# Altium schematic sheet PCB_ManufactureDiagram.SchDoc
size A4; SheetNumber: 6; SheetTotal: 6
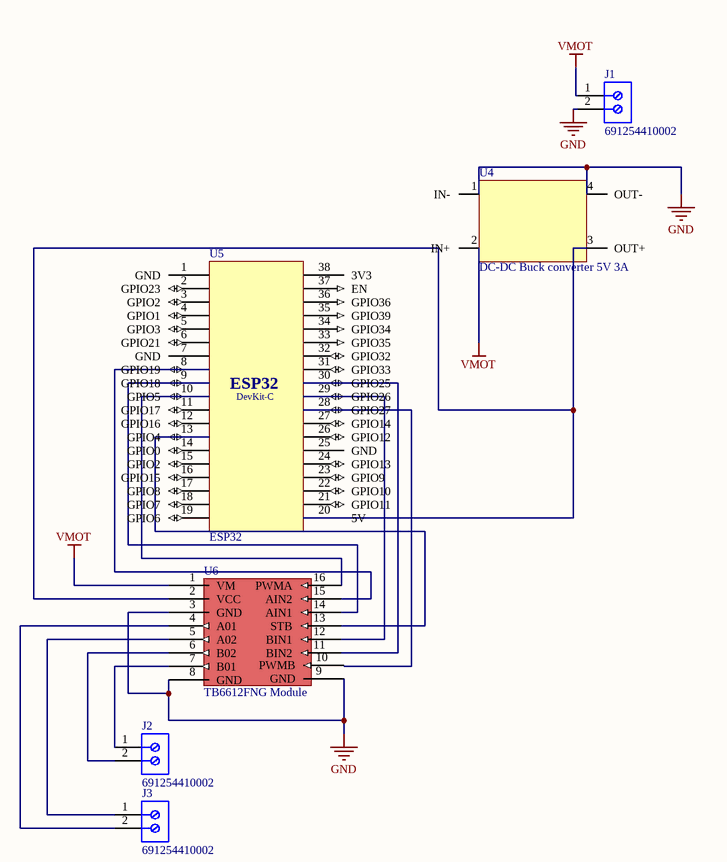
[diagram p0: PCB_ManufactureDiagram.SchDoc]

## Parts
J1  691254410002  [691254410002]
J2  691254410002  [691254410002]
J3  691254410002  [691254410002]
U4  DC-DC Buck converter 5V 3A  [DC-DC Buck converter 5V 3A]
U5  ESP32  [ESP32_DevKitCWROOM32]
U6  TB6612FNG Module  [TB6612FNG]

## Nets
GND: J1.2 U4.1(IN-) U4.4(OUT-) U6.3(GND) U6.8(GND) U6.9(GND)
VMOT: J1.1 U4.2(IN+) U6.1(VM)
NetJ2_1: J2.1 U6.7(B01)
NetJ2_2: J2.2 U6.6(B02)
NetJ3_1: J3.1 U6.5(A02)
NetJ3_2: J3.2 U6.4(A01)
NetU4_3: U4.3(OUT+) U5.20(5V) U6.2(VCC)
NetU5_8: U5.8(GPIO19) U6.15(AIN2)
NetU5_9: U5.9(GPIO18) U6.14(AIN1)
NetU5_10: U5.10(GPIO5) U6.16(PWMA)
NetU5_13: U5.13(GPIO4) U6.13(STB)
NetU5_29: U5.29(GPIO26) U6.12(BIN1)
NetU5_30: U5.30(GPIO25) U6.11(BIN2)

Not connected (* = marked no-connect by the designer): U5 1(GND) 2(GPIO23) 3(GPIO2) 4(GPIO1) 5(GPIO3) 6(GPIO21) 7(GND) 11(GPIO17) 12(GPIO16) 14(GPIO0) 15(GPIO2) 16(GPIO15) 17(GPIO8) 18(GPIO7) 19(GPIO6) 21(GPIO11) 22(GPIO10) 23(GPIO9) 24(GPIO13) 25(GND) 26(GPIO12) 27(GPIO14) 28(GPIO27) 31(GPIO33) 32(GPIO32) 33(GPIO35) 34(GPIO34) 35(GPIO39) 36(GPIO36) 37(EN) 38(3V3); U6 10(PWMB)

## Notes on the sheet
- Documento:
- Autor:
- Carnet:
- Proyecto:
- Curso:
- Fecha:
- Revisión:
- Tamaño:
- Carta
- Hoja:
- de:
- (in symbol ESP32-WROOM32) DevKit-C

## Library data of the parts
J1-J3 = CMP-1502-02748-3: Terminal Block, 7.62MM Pitch, Horizontal, Dual Pin, 12-30 AWG, 2 Pin
U4 = DC-DC Buck converter 5V 3A: MP1584 Series 28 V 3 A 1.5 MHz SMT Step-Down Converter - SOIC-8E; Manufacturer: Monolithic Power Systems; Manufacturer Part Number: MP1584EN-LF-Z; Manufacturer Lifecycle Status: NRFND; Max Supply Voltage: 28V; Max Junction Temperature (Tj): 125°C; Max Output Voltage: 25V; Max Power Dissipation: 2.5W; Max Switching Frequency: 1.5MHz; Min Input Voltage: 4.5V; Min Output Voltage: 800mV; Nominal Supply Voltage: 12V; Nominal Supply Current: 100µA; Number of Channels: 1; Output Configuration: Positive; Output Type: Adjustable; Synchronous Rectifier: No; Supplier: DigiKey; Supplier Part Number: 1589-1533-1-ND; RoHS: Compliant; Category: Voltage Regulators - Switching; Stock: 3098; Pricing: 1=2.75, 10=2.051, 25=1.876, 100=1.6842, 250=1.59268, 500=1.53748, 1000=1.49207 (USD); Ambient Temperature Range High: 85°C; Case/Package: SOIC; Contact Plating: Tin; Height: 1.7mm; Height - Seated (Max): 1.7mm; Lead Free: Lead Free; Length: 4.9mm; Lifecycle Status: NRND; Max Operating Temperature: 85°C; Max Output current: 3A; Min Operating Temperature: -20°C; Min Supply Voltage: 4.5V; Mounting Technology: Surface Mount; Number of Circuits: 1; Number of Outputs: 1; Pins: 8; Number of Terminals: 8; Operating Supply Voltage: 28V; Output Current: 3A; Output Voltage: 25V; REACH SVHC: Yes; Switching Frequency: 1.5MHz; Terminal Pitch: 1.27mm; Topology: Buck; Width: 3.9mm; ComponentLink1URL: https://datasheet.octopart.com:443/MP1584EN-LF-Z-Monolithic-Power-Systems-datasheet-155981995.pdf?src-supplier=Monolithic+Power+Systems; ComponentLink1Description: https://datasheet.octopart.com:443/MP1584EN-LF-Z-Monolithic-Power-Systems-datasheet-155981995.pdf?src-supplier=Monolithic+Power+Systems; ComponentLink2URL: https://datasheet.octopart.com:443/MP1584EN-LF-Z-Monolithic-Power-Systems-datasheet-180786201.pdf?src-supplier=IHS; ComponentLink2Description: https://datasheet.octopart.com:443/MP1584EN-LF-Z-Monolithic-Power-Systems-datasheet-180786201.pdf?src-supplier=IHS; ComponentLink3URL: https://datasheet.octopart.com:443/MP1584EN-LF-Z-Monolithic-Power-Systems-datasheet-138896877.pdf?src-supplier=Upverter; ComponentLink3Description: https://datasheet.octopart.com:443/MP1584EN-LF-Z-Monolithic-Power-Systems-datasheet-138896877.pdf?src-supplier=Upverter; ComponentLink4URL: https://datasheet.octopart.com:443/MP1584EN-LF-Z-Monolithic-Power-Systems-datasheet-28355791.pdf?src-supplier=Augswan; ComponentLink4Description: https://datasheet.octopart.com:443/MP1584EN-LF-Z-Monolithic-Power-Systems-datasheet-28355791.pdf?src-supplier=Augswan; ComponentLink5URL: https://datasheet.octopart.com:443/MP1584EN-LF-Z-Monolithic-Power-Systems-datasheet-157246321.pdf?src-supplier=LKR; ComponentLink5Description: https://datasheet.octopart.com:443/MP1584EN-LF-Z-Monolithic-Power-Systems-datasheet-157246321.pdf?src-supplier=LKR; ComponentLink6URL: https://datasheet.octopart.com:443/MP1584EN-LF-Z-Monolithic-Power-Systems-datasheet-130112029.pdf?src-supplier=TME; ComponentLink6Description: https://datasheet.octopart.com:443/MP1584EN-LF-Z-Monolithic-Power-Systems-datasheet-130112029.pdf?src-supplier=TME; ComponentLink7URL: https://datasheet.octopart.com:443/MP1584EN-LF-Z-Monolithic-Power-Systems-datasheet-26504489.pdf?src-supplier=Future+Electronics; ComponentLink7Description: https://datasheet.octopart.com:443/MP1584EN-LF-Z-Monolithic-Power-Systems-datasheet-26504489.pdf?src-supplier=Future+Electronics
U5 = ESP32-WROOM32: Multiprotocol Modules SMD Module ESP32-WROOM-32E, ESP32-D0WD-V3, 16 MB SPI flash, PCB antenna; Manufacturer: Espressif Systems; Manufacturer Part Number: ESP32-WROOM-32E-N16; Max Supply Voltage: 3.6V; Min Supply Voltage: 3V; Operating Supply Voltage: 3.3V; Supplier: DigiKey; Supplier Part Number: 5407-ESP32-WROOM-32E-N16CT-ND; RoHS: Compliant; Category: RF Transceiver Modules and Modems; Stock: 9659; Pricing: 1=5.71, 10=4.941, 25=4.6748, 100=4.3087, 250=4.0894 (USD); Height - Seated (Max): 3.25mm; Harmonized Tariff Schedule (HTS) Code: 8542.31.00.30; Length: 25.5mm; Max Operating Temperature: 85°C; Min Operating Temperature: -40°C; Number of Terminals: 38; REACH SVHC: Yes; Terminal Pitch: 1.27mm; Width: 18mm; ComponentLink1URL: https://datasheet.octopart.com:443/ESP32-WROOM-32E-N16-Espressif-Systems-datasheet-182247776.pdf?src-supplier=IHS; ComponentLink1Description: https://datasheet.octopart.com:443/ESP32-WROOM-32E-N16-Espressif-Systems-datasheet-182247776.pdf?src-supplier=IHS; ComponentLink2URL: https://datasheet.octopart.com:443/ESP32-WROOM-32E-N16-Espressif-Systems-datasheet-192340067.pdf?src-supplier=HQonline; ComponentLink2Description: https://datasheet.octopart.com:443/ESP32-WROOM-32E-N16-Espressif-Systems-datasheet-192340067.pdf?src-supplier=HQonline; ComponentLink3URL: https://datasheet.octopart.com:443/ESP32-WROOM-32E-N16-Espressif-Systems-datasheet-188867343.pdf?src-supplier=TME; ComponentLink3Description: https://datasheet.octopart.com:443/ESP32-WROOM-32E-N16-Espressif-Systems-datasheet-188867343.pdf?src-supplier=TME; ComponentLink4URL: https://datasheet.octopart.com:443/ESP32-WROOM-32E-N16-Espressif-Systems-datasheet-165560559.pdf?src-supplier=TME; ComponentLink4Description: https://datasheet.octopart.com:443/ESP32-WROOM-32E-N16-Espressif-Systems-datasheet-165560559.pdf?src-supplier=TME; ComponentLink5URL: https://datasheet.octopart.com:443/ESP32-WROOM-32E-N16-Espressif-Systems-datasheet-151884363.pdf?src-supplier=Future+Electronics; ComponentLink5Description: https://datasheet.octopart.com:443/ESP32-WROOM-32E-N16-Espressif-Systems-datasheet-151884363.pdf?src-supplier=Future+Electronics
U6 = TB6612FNG: TB6612FNG Motion Motor Control Add-On Board; Manufacturer: SparkFun; Manufacturer Part Number: ROB-14451; Supplier: Mouser; Supplier Part Number: ROB-14451; Category: Uncategorized; Pricing: 1=5.5 (USD); RoHS: Non-Compliant